# EasyEDA Pro project Project.epro, board PCB_AIO Hammond Faceplate - Standard
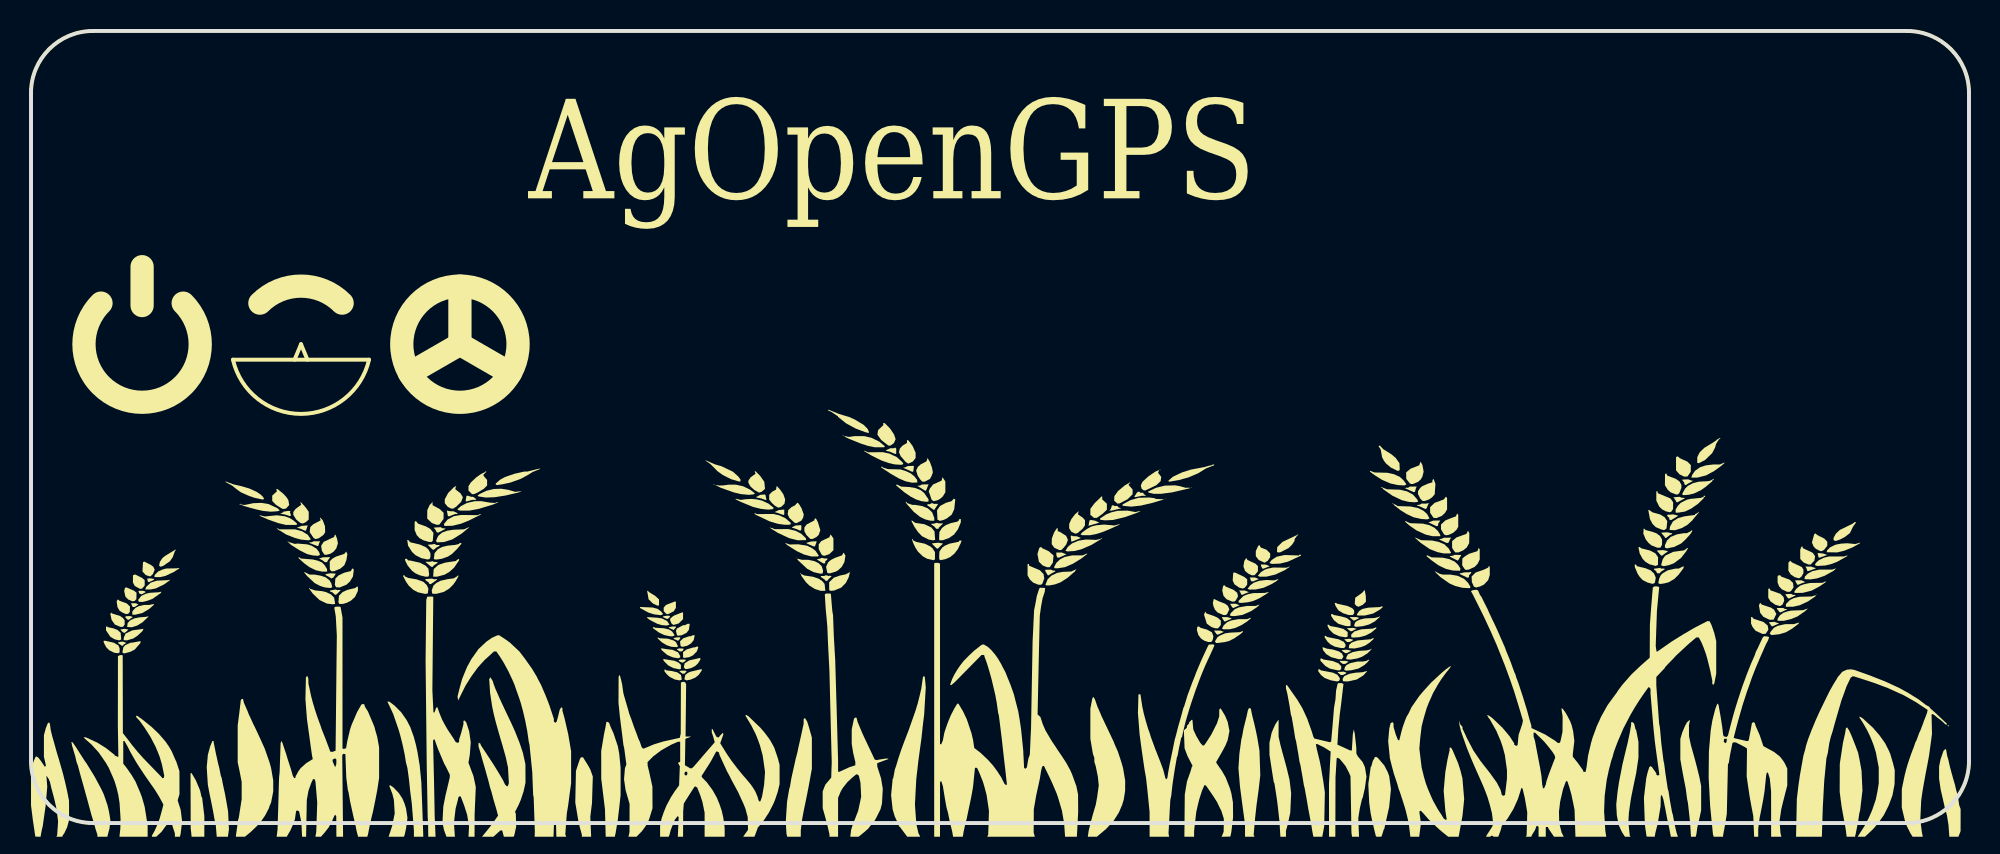
[diagram p6: board, top side]
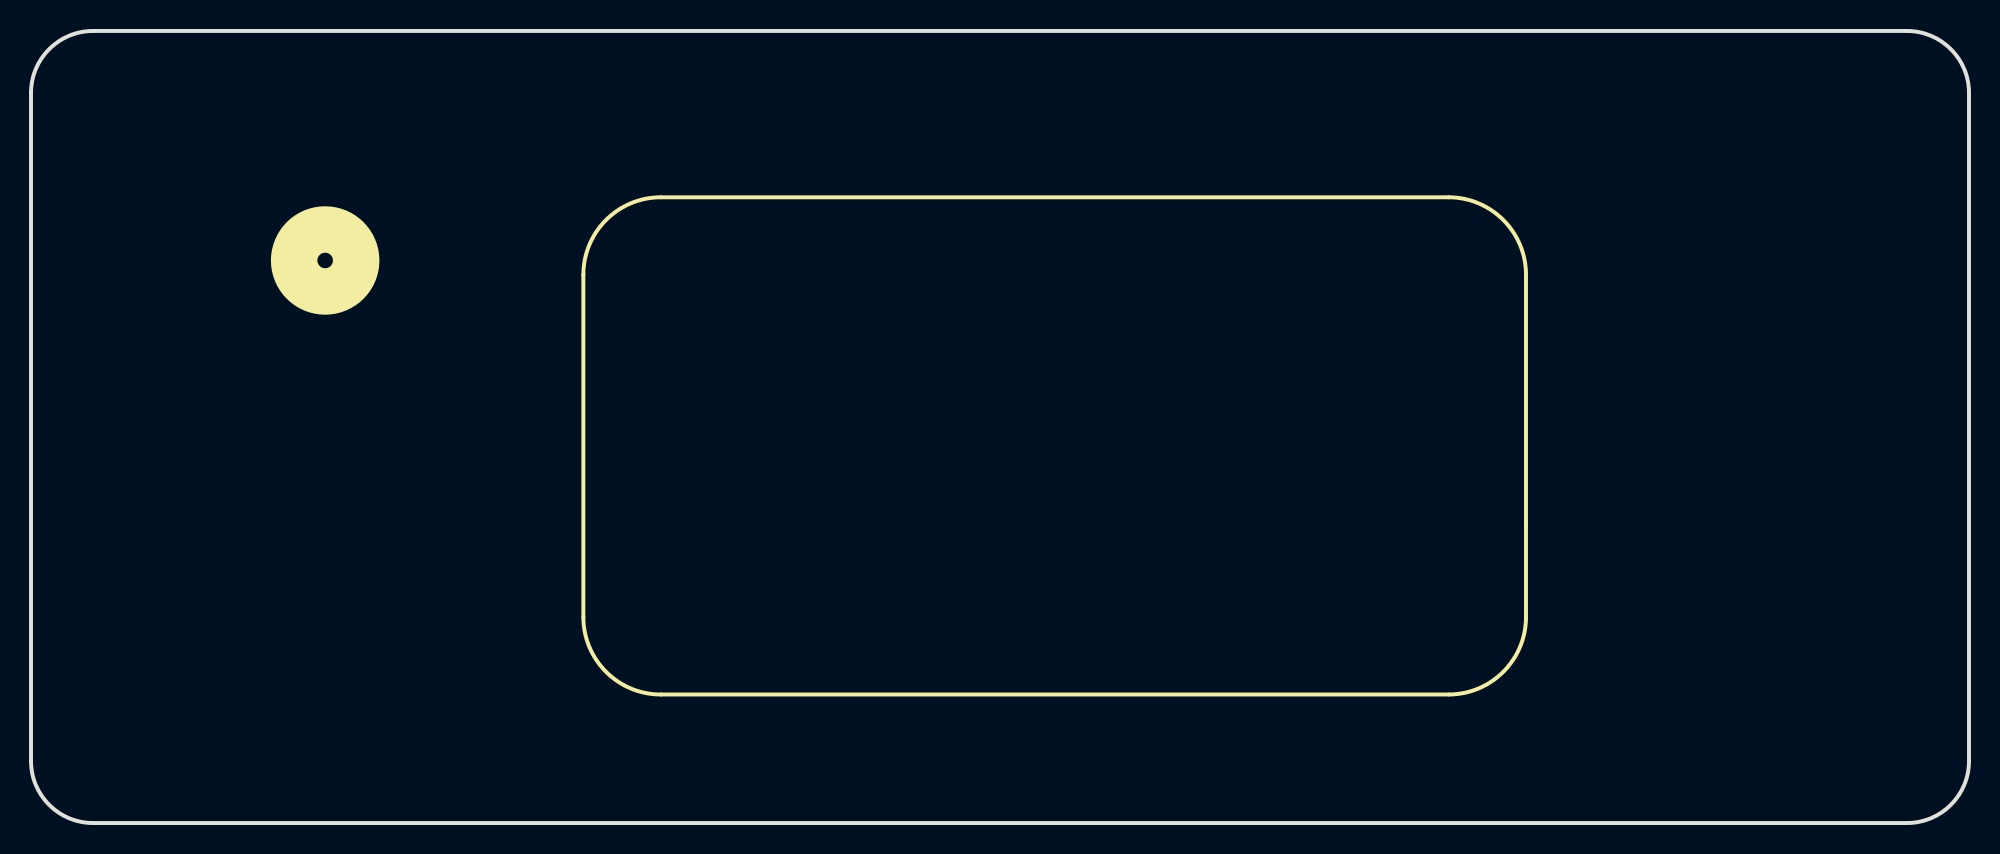
[diagram p7: board, bottom side, seen from below]

Outline 125 x 51.13 mm; copper layers: Top Layer, Bottom Layer. Coordinates in mm from the lower left corner of the outline.
Outline path: 0,47.13 0,4 arc(1.17,1.17) 4,0 121,0 arc(123.83,1.17) 125,4 125,47.13 arc(123.83,49.96) 121,51.13 4,51.13 arc(1.17,49.96) 0,47.13
Stack: Top Layer 0.035mm / Dielectric1 1.51mm FR4 er 4.5 / Bottom Layer 0.035mm

## Design rules (mm)
spacing Default (default): track to track 0.152, other pairs 0 to 0.152
track width Default (default): min 0.254, default 0.254, max 25.4
differential pair differentialPair (default): width min 0.127, default 0.254, max 2.54; gap min 0.152, default 0.152
via Default (default): diameter min 0.4, default 0.4, max 100.025; hole min 0.2, default 0.2, max 59.995

## Placement (name value [footprint] x y rotation side)

## Nets

## Text on the board
Top Silkscreen Layer: AgOpenGPS
